# EAGLE design hot-plate_heater_v1.0 (EAGLE 6.2)

## Sheet 1 of 3
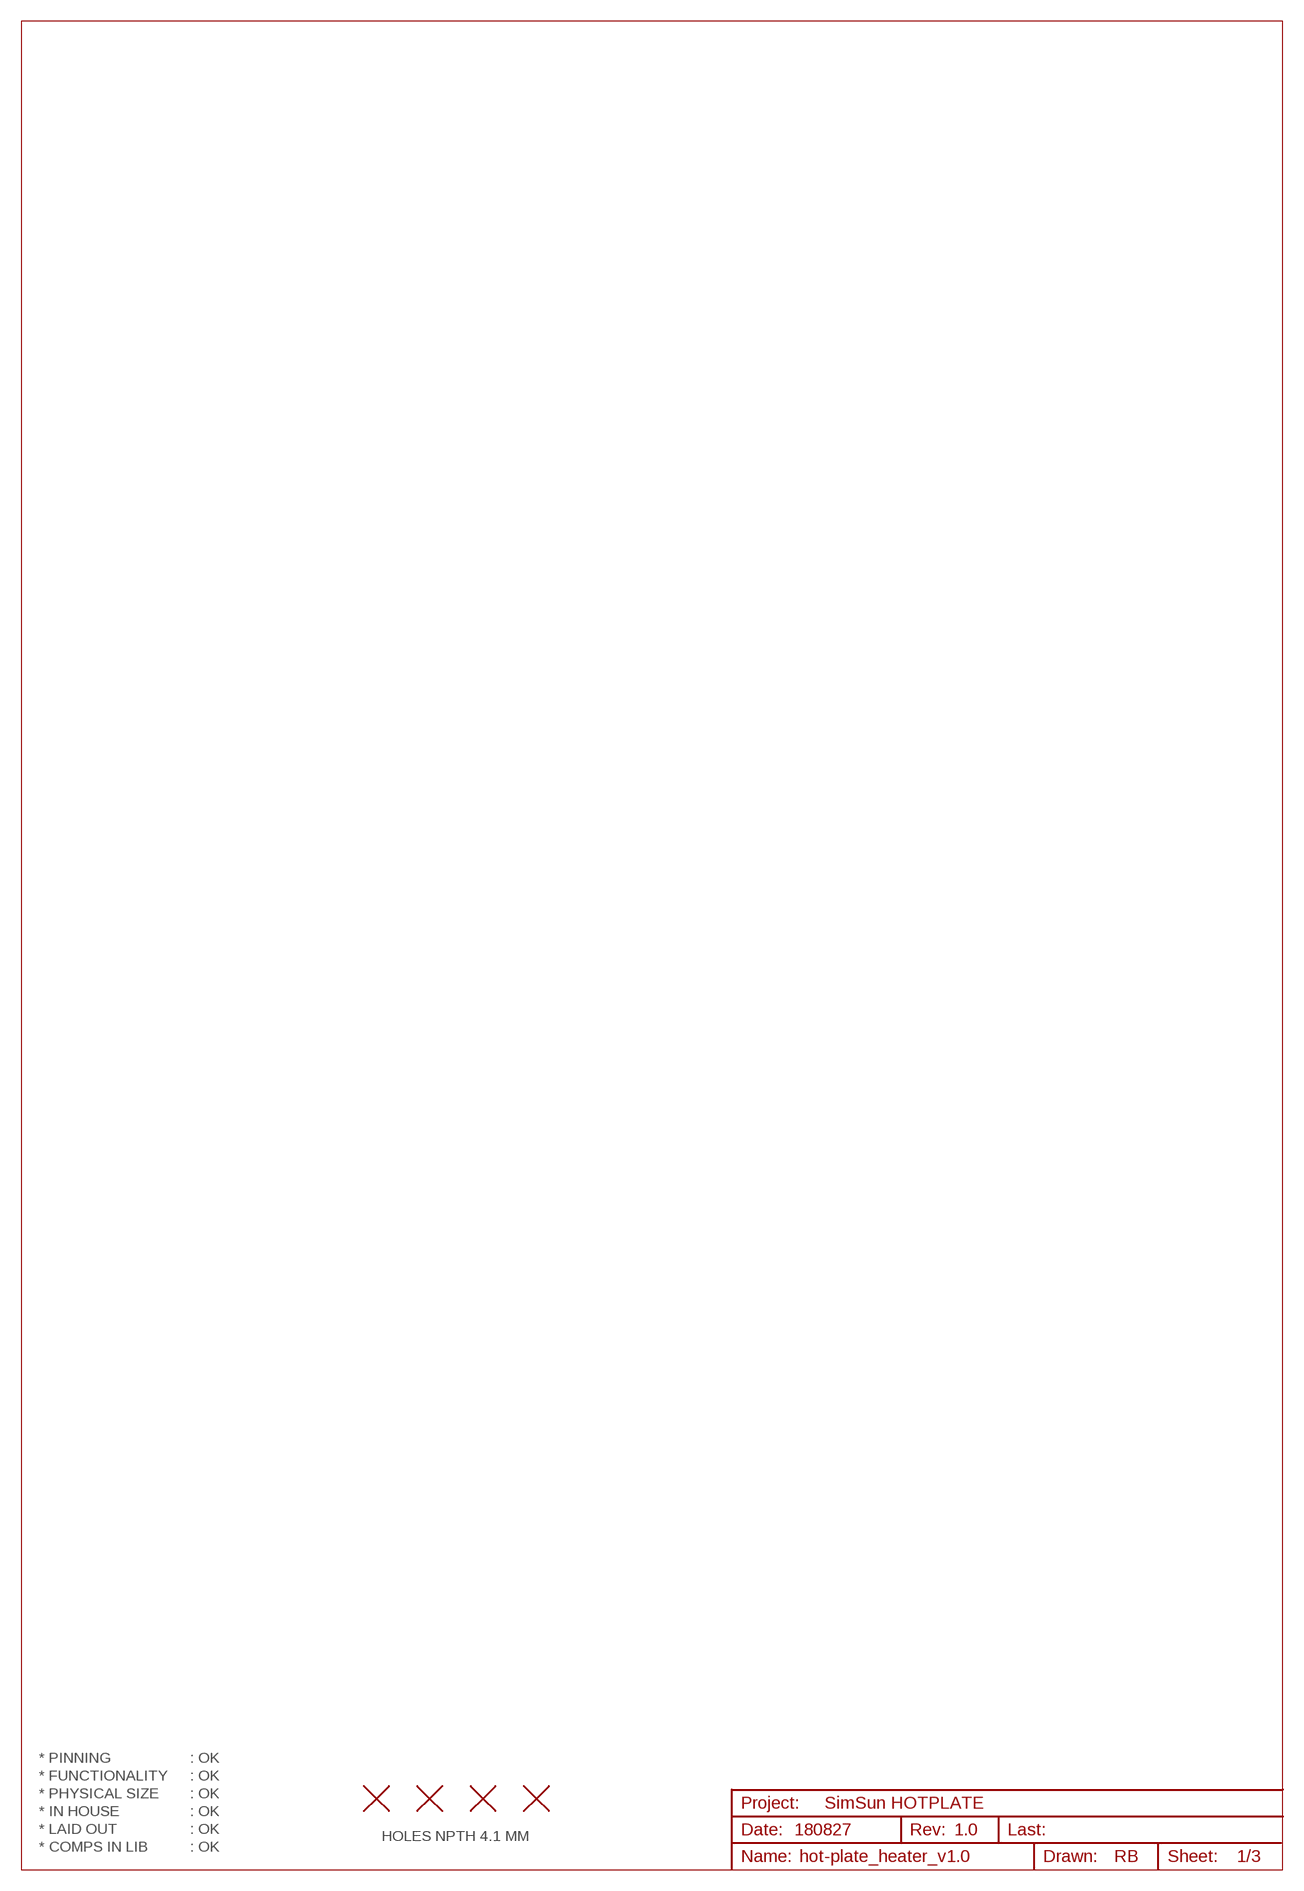
[diagram p0: schematic, sheet 1]

### Parts
H1  HOLE_NPTH_4.1MM  [HOLE_NPTH_4.1MM]
H2  HOLE_NPTH_4.1MM  [HOLE_NPTH_4.1MM]
H3  HOLE_NPTH_4.1MM  [HOLE_NPTH_4.1MM]
H4  HOLE_NPTH_4.1MM  [HOLE_NPTH_4.1MM]

### Notes on the sheet
- * PINNING | : OK
- * FUNCTIONALITY | : OK
- * PHYSICAL SIZE | : OK
- SimSun HOTPLATE
- * IN HOUSE | : OK
- * LAID OUT | : OK | 180827 | 1.0
- HOLES NPTH 4.1 MM
- * COMPS IN LIB | : OK

## Sheet 2 of 3
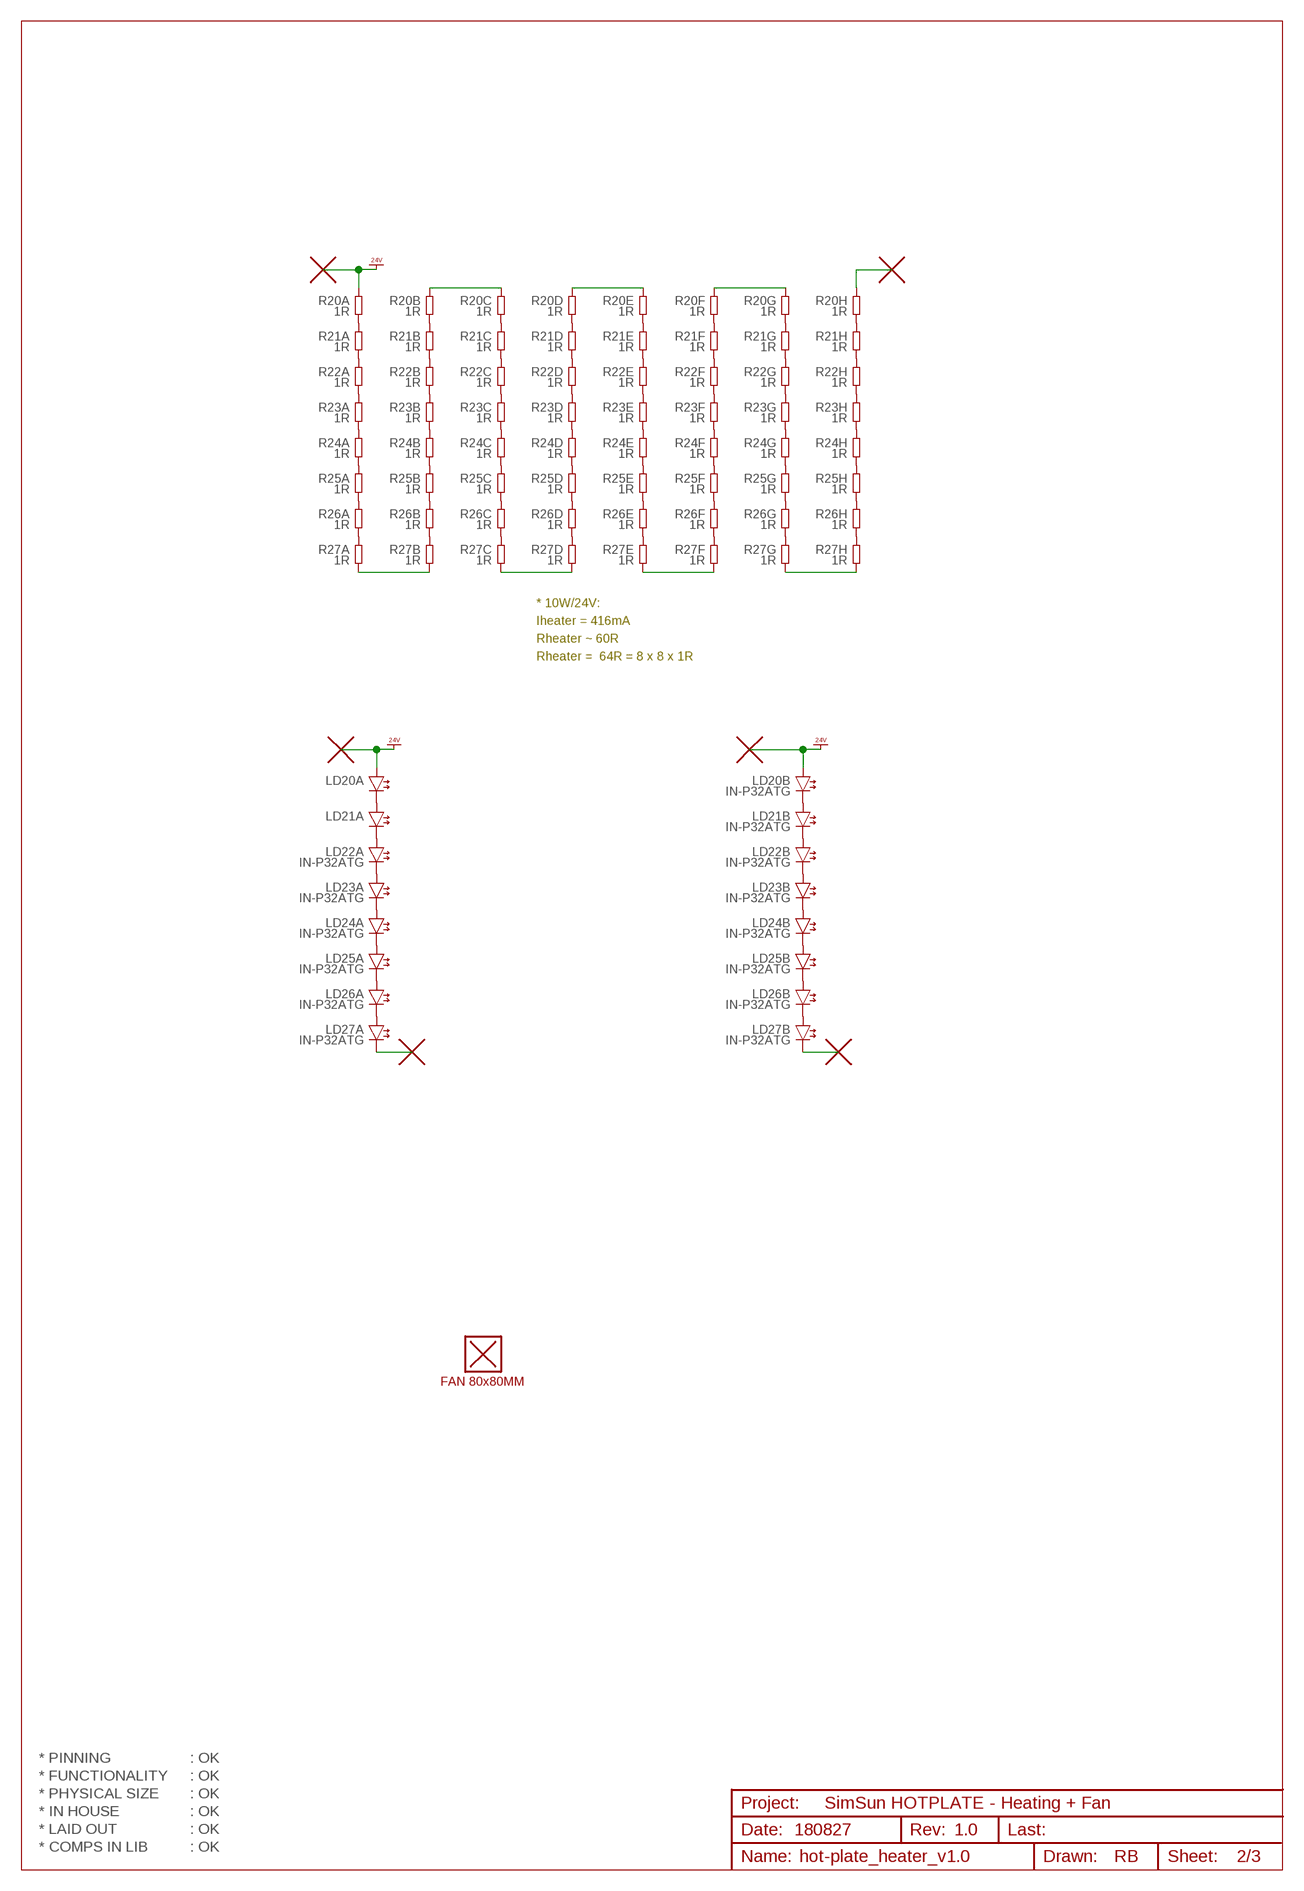
[diagram p1: schematic, sheet 2]

### Parts
H9  FAN_80X80MM_SANYO_SANACE80  [FAN_80X80MM_SANYO_SANACE80]
H18  PAD_ROUND_3.2MM  [PAD_ROUND_3.2MM]
H19  PAD_ROUND_3.2MM  [PAD_ROUND_3.2MM]
H20  PAD_ROUND_3.2MM  [PAD_ROUND_3.2MM]
H21  PAD_ROUND_3.2MM  [PAD_ROUND_3.2MM]
H22  PAD_ROUND_3.2MM  [PAD_ROUND_3.2MM]
H23  PAD_ROUND_3.2MM  [PAD_ROUND_3.2MM]
LD20A  IN-P32ATG  LED_SMD_PLCC2  [LED_SMD_PLCC2]
LD20B  IN-P32ATG  LED_SMD_PLCC2  [LED_SMD_PLCC2]
LD21A  IN-P32ATG  LED_SMD_PLCC2  [LED_SMD_PLCC2]
LD21B  IN-P32ATG  LED_SMD_PLCC2  [LED_SMD_PLCC2]
LD22A  IN-P32ATG  LED_SMD_PLCC2  [LED_SMD_PLCC2]
LD22B  IN-P32ATG  LED_SMD_PLCC2  [LED_SMD_PLCC2]
LD23A  IN-P32ATG  LED_SMD_PLCC2  [LED_SMD_PLCC2]
LD23B  IN-P32ATG  LED_SMD_PLCC2  [LED_SMD_PLCC2]
LD24A  IN-P32ATG  LED_SMD_PLCC2  [LED_SMD_PLCC2]
LD24B  IN-P32ATG  LED_SMD_PLCC2  [LED_SMD_PLCC2]
LD25A  IN-P32ATG  LED_SMD_PLCC2  [LED_SMD_PLCC2]
LD25B  IN-P32ATG  LED_SMD_PLCC2  [LED_SMD_PLCC2]
LD26A  IN-P32ATG  LED_SMD_PLCC2  [LED_SMD_PLCC2]
LD26B  IN-P32ATG  LED_SMD_PLCC2  [LED_SMD_PLCC2]
LD27A  IN-P32ATG  LED_SMD_PLCC2  [LED_SMD_PLCC2]
LD27B  IN-P32ATG  LED_SMD_PLCC2  [LED_SMD_PLCC2]
R20A  1R  RES2512  [RES2512]
R20B  1R  RES2512  [RES2512]
R20C  1R  RES2512  [RES2512]
R20D  1R  RES2512  [RES2512]
R20E  1R  RES2512  [RES2512]
R20F  1R  RES2512  [RES2512]
R20G  1R  RES2512  [RES2512]
R20H  1R  RES2512  [RES2512]
R21A  1R  RES2512  [RES2512]
R21B  1R  RES2512  [RES2512]
R21C  1R  RES2512  [RES2512]
R21D  1R  RES2512  [RES2512]
R21E  1R  RES2512  [RES2512]
R21F  1R  RES2512  [RES2512]
R21G  1R  RES2512  [RES2512]
R21H  1R  RES2512  [RES2512]
R22A  1R  RES2512  [RES2512]
R22B  1R  RES2512  [RES2512]
R22C  1R  RES2512  [RES2512]
R22D  1R  RES2512  [RES2512]
R22E  1R  RES2512  [RES2512]
R22F  1R  RES2512  [RES2512]
R22G  1R  RES2512  [RES2512]
R22H  1R  RES2512  [RES2512]
R23A  1R  RES2512  [RES2512]
R23B  1R  RES2512  [RES2512]
R23C  1R  RES2512  [RES2512]
R23D  1R  RES2512  [RES2512]
R23E  1R  RES2512  [RES2512]
R23F  1R  RES2512  [RES2512]
R23G  1R  RES2512  [RES2512]
R23H  1R  RES2512  [RES2512]
R24A  1R  RES2512  [RES2512]
R24B  1R  RES2512  [RES2512]
R24C  1R  RES2512  [RES2512]
R24D  1R  RES2512  [RES2512]
R24E  1R  RES2512  [RES2512]
R24F  1R  RES2512  [RES2512]
R24G  1R  RES2512  [RES2512]
R24H  1R  RES2512  [RES2512]
R25A  1R  RES2512  [RES2512]
R25B  1R  RES2512  [RES2512]
R25C  1R  RES2512  [RES2512]
R25D  1R  RES2512  [RES2512]
R25E  1R  RES2512  [RES2512]
R25F  1R  RES2512  [RES2512]
R25G  1R  RES2512  [RES2512]
R25H  1R  RES2512  [RES2512]
R26A  1R  RES2512  [RES2512]
R26B  1R  RES2512  [RES2512]
R26C  1R  RES2512  [RES2512]
R26D  1R  RES2512  [RES2512]
R26E  1R  RES2512  [RES2512]
R26F  1R  RES2512  [RES2512]
R26G  1R  RES2512  [RES2512]
R26H  1R  RES2512  [RES2512]
R27A  1R  RES2512  [RES2512]
R27B  1R  RES2512  [RES2512]
R27C  1R  RES2512  [RES2512]
R27D  1R  RES2512  [RES2512]
R27E  1R  RES2512  [RES2512]
R27F  1R  RES2512  [RES2512]
R27G  1R  RES2512  [RES2512]
R27H  1R  RES2512  [RES2512]

### Nets
N$1: H19.P R20H.1
N$4: R20A.2 R21A.1
N$5: R21A.2 R22A.1
N$6: R22A.2 R23A.1
N$7: R23A.2 R24A.1
N$8: R24A.2 R25A.1
N$9: R25A.2 R26A.1
N$10: R26A.2 R27A.1
N$11: R20B.2 R21B.1
N$12: R21B.2 R22B.1
N$14: R22B.2 R23B.1
N$15: R23B.2 R24B.1
N$16: R24B.2 R25B.1
N$17: R25B.2 R26B.1
N$18: R26B.2 R27B.1
N$19: R27A.2 R27B.2
N$20: R20C.2 R21C.1
N$21: R21C.2 R22C.1
N$22: R22C.2 R23C.1
N$23: R23C.2 R24C.1
N$24: R24C.2 R25C.1
N$26: R25C.2 R26C.1
N$27: R26C.2 R27C.1
N$28: R20B.1 R20C.1
N$29: R20D.2 R21D.1
N$30: R21D.2 R22D.1
N$31: R22D.2 R23D.1
N$32: R23D.2 R24D.1
N$33: R24D.2 R25D.1
N$34: R25D.2 R26D.1
N$35: R26D.2 R27D.1
N$36: R27C.2 R27D.2
N$37: R20E.2 R21E.1
N$38: R21E.2 R22E.1
N$39: R22E.2 R23E.1
N$40: R23E.2 R24E.1
N$41: R24E.2 R25E.1
N$42: R25E.2 R26E.1
N$43: R26E.2 R27E.1
N$44: R20D.1 R20E.1
N$45: R20F.2 R21F.1
N$46: R21F.2 R22F.1
N$47: R22F.2 R23F.1
N$48: R23F.2 R24F.1
N$49: R24F.2 R25F.1
N$50: R25F.2 R26F.1
N$51: R26F.2 R27F.1
N$52: R27E.2 R27F.2
N$53: R20G.2 R21G.1
N$54: R21G.2 R22G.1
N$55: R22G.2 R23G.1
N$56: R23G.2 R24G.1
N$57: R24G.2 R25G.1
N$58: R25G.2 R26G.1
N$59: R26G.2 R27G.1
N$60: R20F.1 R20G.1
N$61: R20H.2 R21H.1
N$62: R21H.2 R22H.1
N$63: R22H.2 R23H.1
N$64: R23H.2 R24H.1
N$65: R24H.2 R25H.1
N$66: R25H.2 R26H.1
N$67: R26H.2 R27H.1
N$68: R27G.2 R27H.2
N$71: LD20A.C(-) LD21A.A(+)
N$72: LD21A.C(-) LD22A.A(+)
N$73: LD22A.C(-) LD23A.A(+)
N$74: LD23A.C(-) LD24A.A(+)
N$75: LD24A.C(-) LD25A.A(+)
N$76: LD25A.C(-) LD26A.A(+)
N$77: LD20B.C(-) LD21B.A(+)
N$78: LD21B.C(-) LD22B.A(+)
N$79: LD22B.C(-) LD23B.A(+)
N$80: LD23B.C(-) LD24B.A(+)
N$81: LD24B.C(-) LD25B.A(+)
N$82: LD25B.C(-) LD26B.A(+)
N$83: LD26A.C(-) LD27A.A(+)
N$84: LD26B.C(-) LD27B.A(+)
N$85: H23.P LD27B.C(-)
N$86: H22.P LD27A.C(-)
VDD_24V: H18.P H20.P H21.P LD20A.A(+) LD20B.A(+) R20A.1 ; supply symbol labelled VCC_24V

### Notes on the sheet
- * 10W/24V:
- Iheater = 416mA
- Rheater ~ 60R
- Rheater =  64R = 8 x 8 x 1R
- * PINNING | : OK
- * FUNCTIONALITY | : OK
- * PHYSICAL SIZE | : OK
- SimSun HOTPLATE - Heating + Fan
- * IN HOUSE | : OK
- * LAID OUT | : OK | 180827 | 1.0
- * COMPS IN LIB | : OK

## Sheet 3 of 3
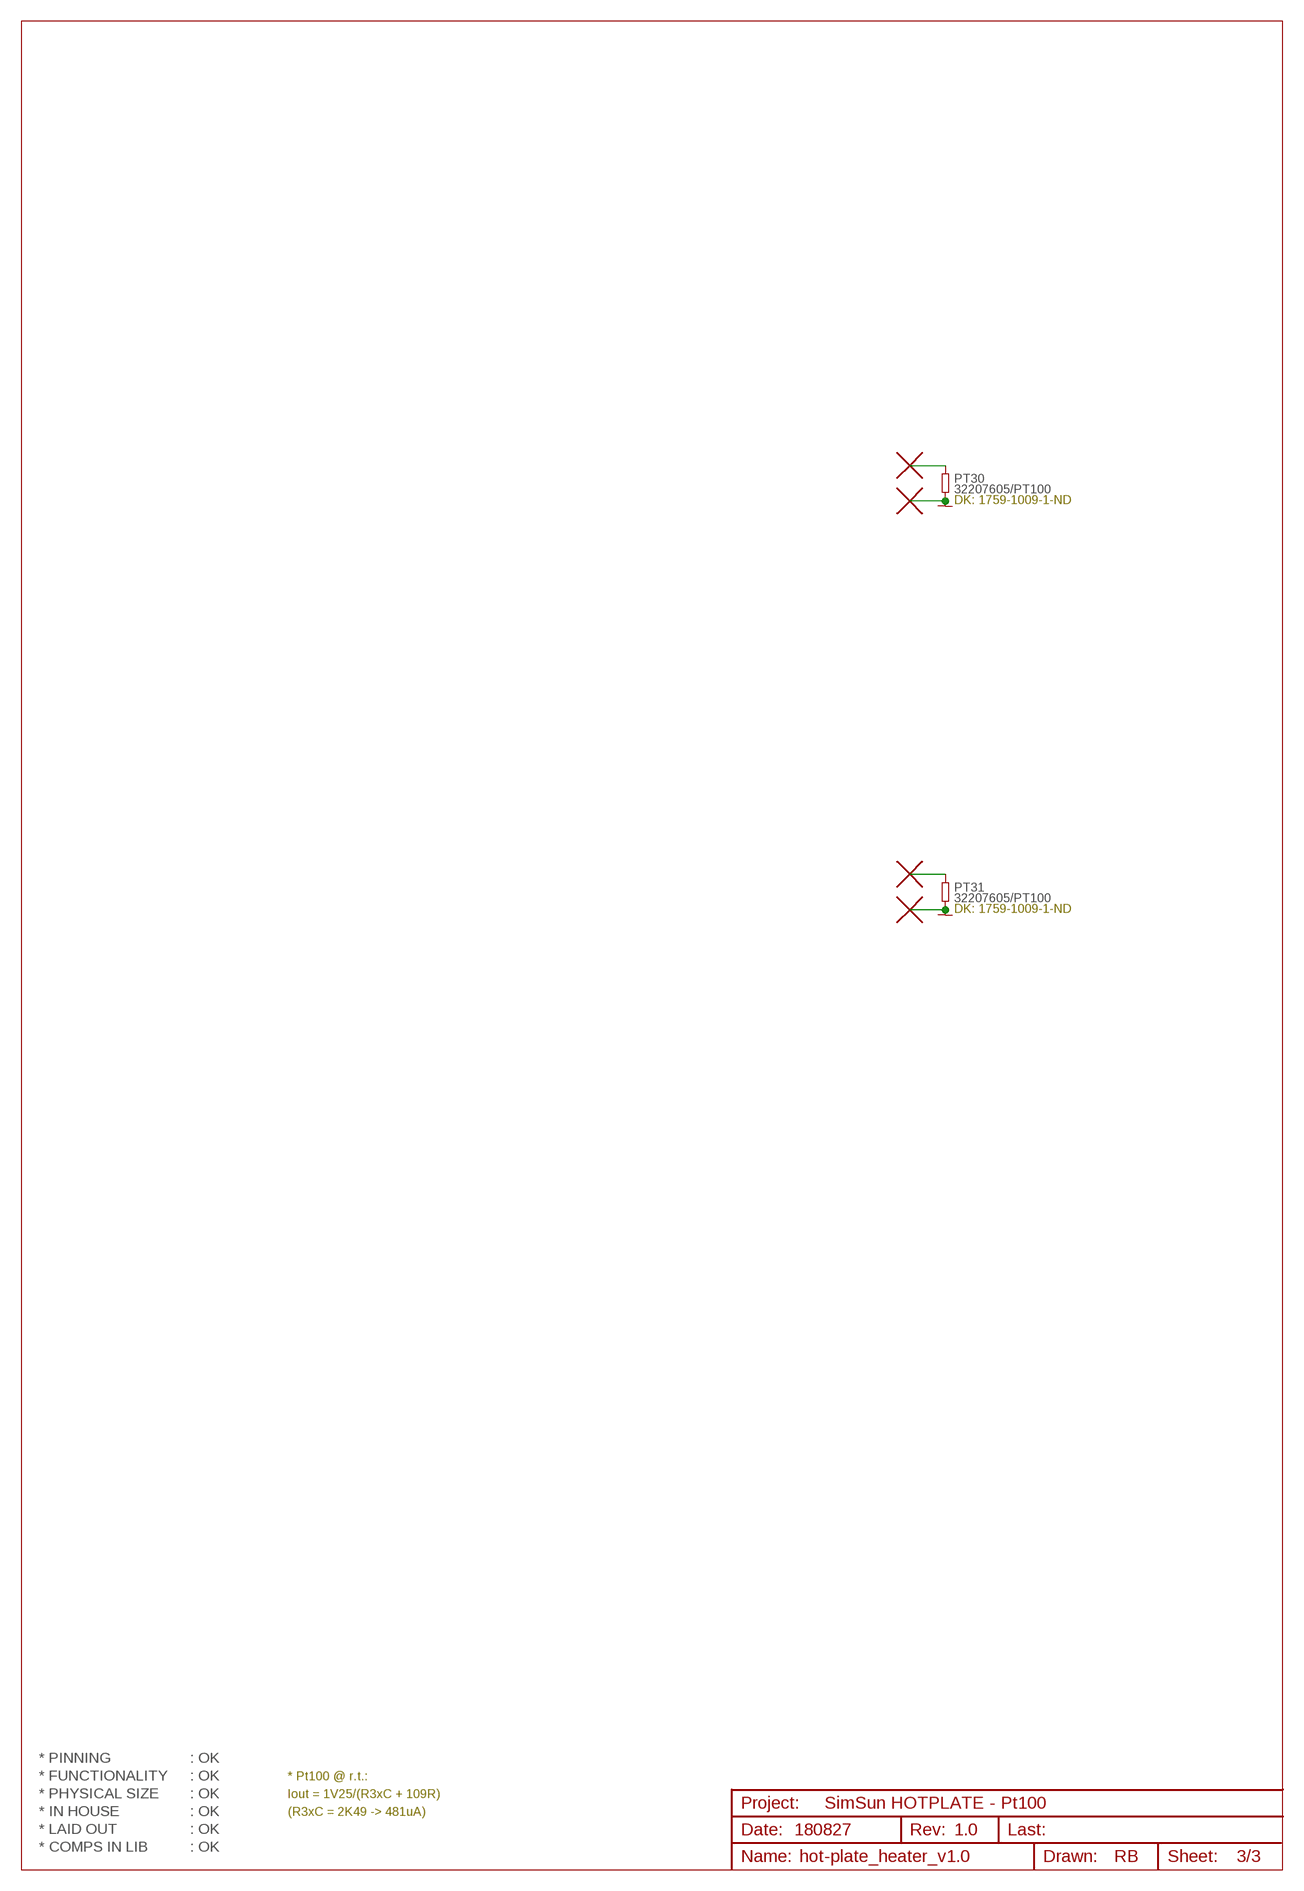
[diagram p2: schematic, sheet 3]

### Parts
H24  PAD_ROUND_3.2MM  [PAD_ROUND_3.2MM]
H25  PAD_ROUND_3.2MM  [PAD_ROUND_3.2MM]
H26  PAD_ROUND_3.2MM  [PAD_ROUND_3.2MM]
H27  PAD_ROUND_3.2MM  [PAD_ROUND_3.2MM]
PT30  32207605/PT100  RES0805  [RES0805]
PT31  32207605/PT100  RES0805  [RES0805]

### Nets
GND: H25.P H27.P PT30.2 PT31.2
RTD30: H24.P PT30.1
RTD31: H26.P PT31.1

### Notes on the sheet
- DK: 1759-1009-1-ND
- DK: 1759-1009-1-ND
- * PINNING | : OK
- * FUNCTIONALITY | : OK | * Pt100 @ r.t.:
- * PHYSICAL SIZE | : OK | Iout = 1V25/(R3xC + 109R)
- SimSun HOTPLATE - Pt100
- * IN HOUSE | : OK | (R3xC = 2K49 -> 481uA)
- * LAID OUT | : OK | 180827 | 1.0
- * COMPS IN LIB | : OK

## Library data of the parts
H1-H4 = 00-own_parts:HOLE_NPTH_4.1MM: Hole, NPTH, 4.1mm
H9 = 00-own_parts:FAN_80X80MM_SANYO_SANACE80: Fan, 80x80MM, Sanyo 9GA0824P7G001, with PWM control function & pulse sensor, DK# 1688-1603-ND
H18-H27 = 00-own_parts:PAD_ROUND_3.2MM: Pad, SMD, round 3.2mm
LD20A LD20B LD21A LD21B LD22A LD22B LD23A LD23B LD24A LD24B LD25A LD25B LD26A LD26B LD27A LD27B = 00-own_parts:LED_SMD_PLCC2: LED, SMD, PLCC2
PT30 PT31 R20A R20B R20C R20D R20E R20F R20G R20H R21A R21B R21C R21D R21E R21F R21G R21H R22A R22B R22C R22D R22E R22F R22G R22H R23A R23B R23C R23D R23E R23F R23G R23H R24A R24B R24C R24D R24E R24F R24G R24H R25A R25B R25C R25D R25E R25F R25G R25H R26A R26B R26C R26D R26E R26F R26G R26H R27A R27B R27C R27D R27E R27F R27G R27H = 00-own_parts:RES

## Board
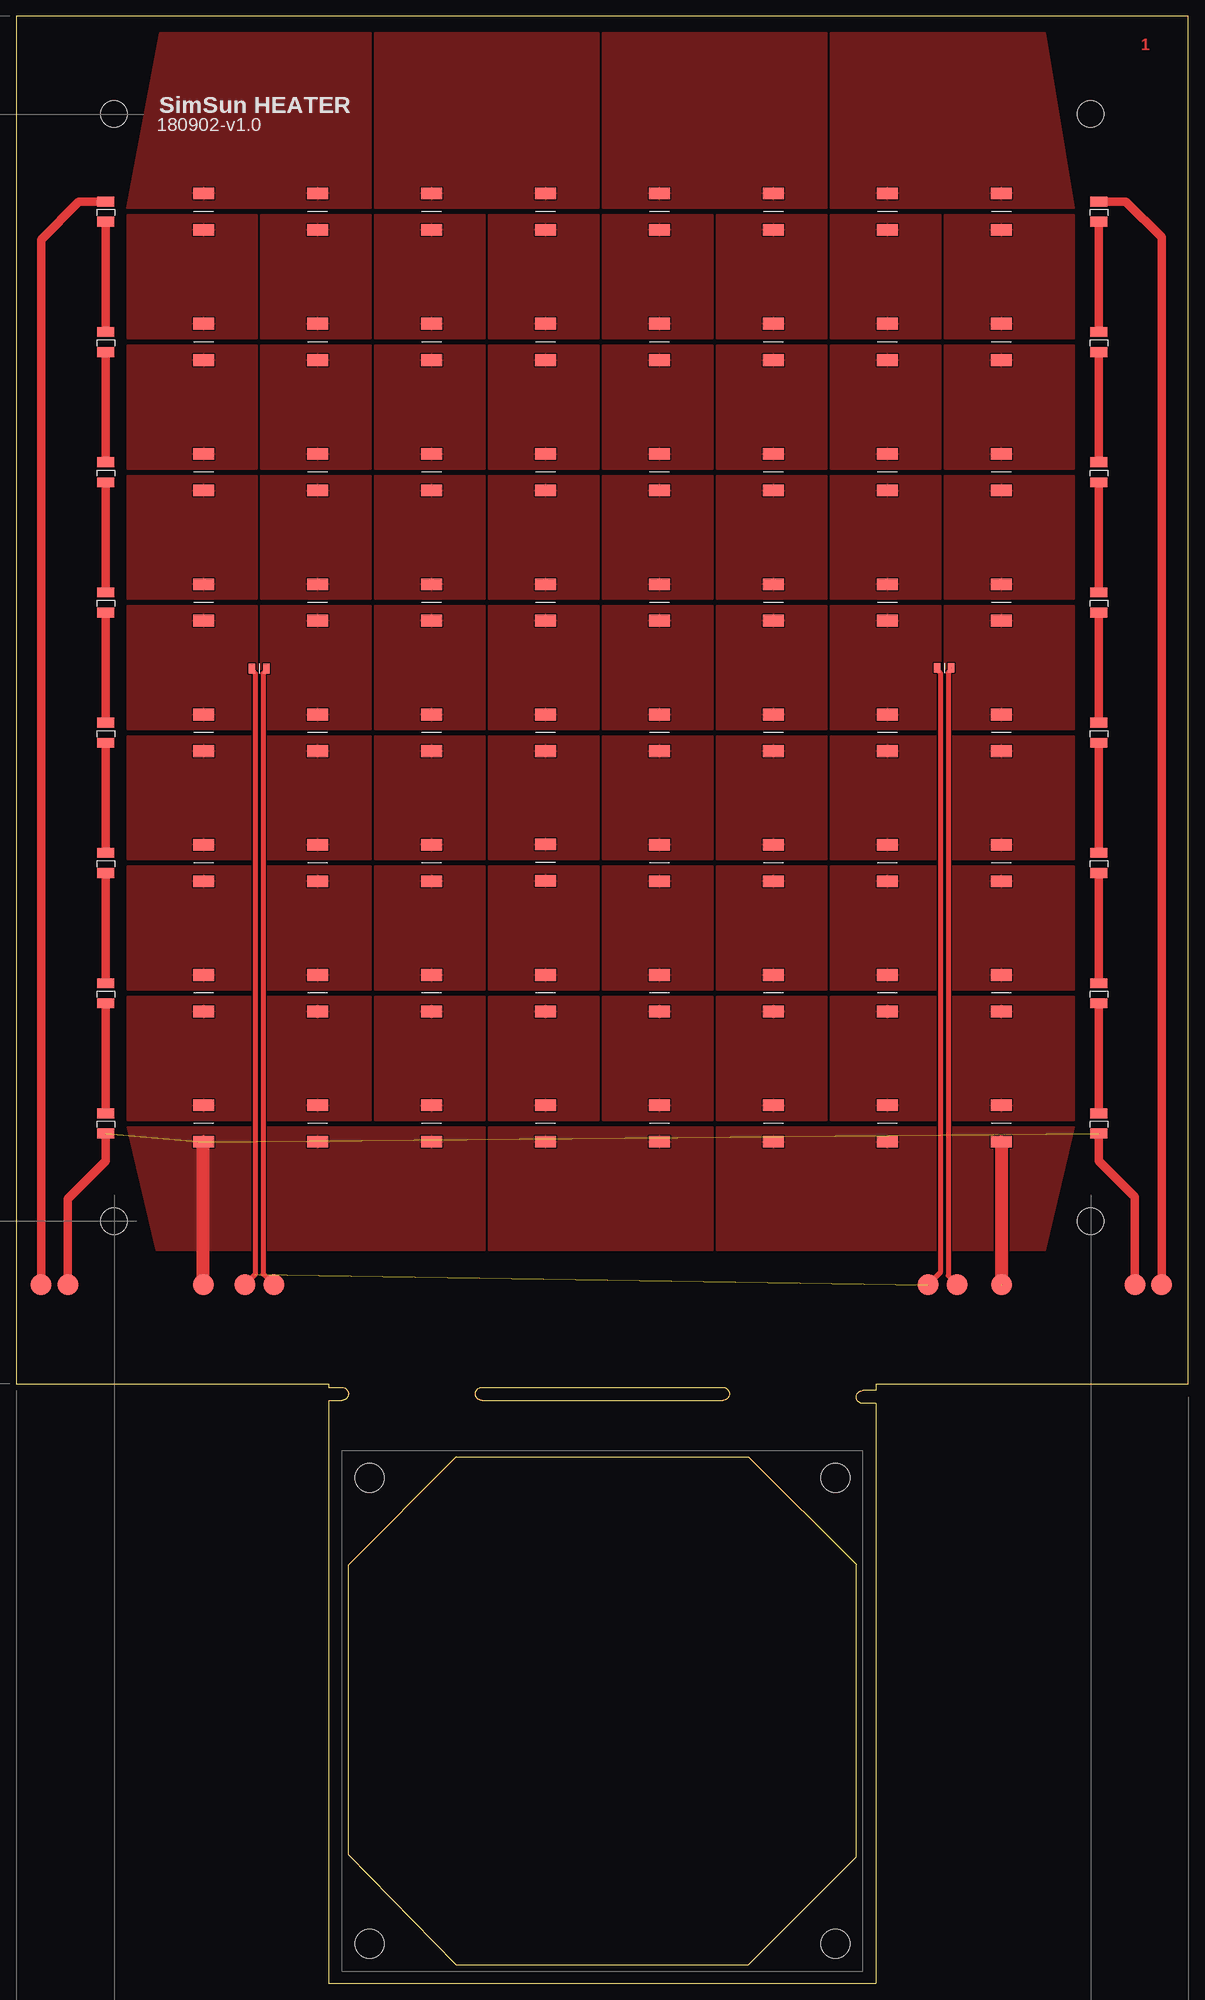
[diagram p3: board, top side]

Size 180 x 302 mm. Coordinates in mm from the lower left corner, seen from the top.
Outline: 0,92 48,92 48,91.5 50,91.5 arc-180 50,89.5 48,89.5 48,0 132,0 132,89 130,89 arc-180 130,91 132,91 132,92 180,92 180,302 0,302 0,92
Copper layers 1: Top 0.035mm
Design rules: minimum track width 0.15mm, minimum drill 1mm, track to track 0.2mm, track to pad 0.2mm, pad to pad 0.2mm, via to via 0.2mm, smd to smd 0.2mm, copper to edge 0.45mm, drill to drill 0.3mm, minimum pad ring 0.325mm, minimum via ring 0.325mm, stop-mask expansion 0.1mm, vias tented up to drill 0mil, thermal gap 0.2mm
Milling: 4 lines

### Footprints (pad centres in the part's own frame; a part is rotated, then mirrored left to right if it is on the bottom)
HOLE_NPTH_4.1MM = hole 4.1: 0,0
FAN_80X80MM_SANYO_SANACE80 = hole 4.5: -35.75,-35.75; 35.75,-35.75; -35.75,35.75; 35.75,35.75
PAD_ROUND_3.2MM = smd 3.2 x 3.2: P 0,0
LED_SMD_PLCC2 = smd 1.5 x 2.6: A -1.55,0; C 1.55,0
RES0805 = smd 1 x 1.5: 1 -1.1,0; 2 1.1,0
RES2512 = smd 1.8 x 3.2: 1 -2.8,0; 2 2.8,0

### Placement (x,y rotation side)
H1  165,287 0 top
H2  15,117 0 top
H3  165,117 0 top
H4  15,287 0 top
H9  90.01,41.83 0 top
H18  7.94,107.24 90 top
H19  151.29,107.24 90 top
H20  171.77,107.24 90 top
H21  28.73,107.24 90 top
H22  3.81,107.24 90 top
H23  175.89,107.24 90 top
H24  144.46,107.24 90 top
H25  140.02,107.24 90 top
H26  39.53,107.24 90 top
H27  35.08,107.24 90 top
LD20A  13.75,132 90 top
LD20B  166.25,132 90 top
LD21A  13.75,152 90 top
LD21B  166.25,152 90 top
LD22A  13.75,172 90 top
LD22B  166.25,172 90 top
LD23A  13.75,192 90 top
LD23B  166.25,192 90 top
LD24A  13.75,212 90 top
LD24B  166.25,212 90 top
LD25A  13.75,232 90 top
LD25B  166.25,232 90 top
LD26A  13.75,252 90 top
LD26B  166.25,252 90 top
LD27A  13.75,272 90 top
LD27B  166.25,272 90 top
PT30  142.49,201.95 180 top
PT31  37.3,201.85 180 top
R20A  28.75,132 90 top
R20B  46.25,132 90 top
R20C  63.75,132 90 top
R20D  81.25,132 90 top
R20E  98.75,132 90 top
R20F  116.25,132 90 top
R20G  133.75,132 90 top
R20H  151.25,132 90 top
R21A  28.75,152 90 top
R21B  46.25,152 90 top
R21C  63.75,152 90 top
R21D  81.25,152 90 top
R21E  98.75,152 90 top
R21F  116.25,152 90 top
R21G  133.75,152 90 top
R21H  151.25,152 90 top
R22A  28.75,172 90 top
R22B  46.25,172 90 top
R22C  63.75,172 90 top
R22D  81.25,172.05 90 top
R22E  98.75,172 90 top
R22F  116.25,172 90 top
R22G  133.75,172 90 top
R22H  151.25,172 90 top
R23A  28.75,192 90 top
R23B  46.25,192 90 top
R23C  63.75,192 90 top
R23D  81.25,192 90 top
R23E  98.75,192 90 top
R23F  116.25,192 90 top
R23G  133.75,192 90 top
R23H  151.25,192 90 top
R24A  28.75,212 90 top
R24B  46.25,212 90 top
R24C  63.75,212 90 top
R24D  81.25,212 90 top
R24E  98.75,212 90 top
R24F  116.25,212 90 top
R24G  133.75,212 90 top
R24H  151.25,212 90 top
R25A  28.75,232 90 top
R25B  46.25,232 90 top
R25C  63.75,232 90 top
R25D  81.25,232 90 top
R25E  98.75,232 90 top
R25F  116.25,232 90 top
R25G  133.75,232 90 top
R25H  151.25,232 90 top
R26A  28.75,252 90 top
R26B  46.25,252 90 top
R26C  63.75,252 90 top
R26D  81.25,252 90 top
R26E  98.75,252 90 top
R26F  116.25,252 90 top
R26G  133.75,252 90 top
R26H  151.25,252 90 top
R27A  28.75,272 90 top
R27B  46.25,272 90 top
R27C  63.75,272 90 top
R27D  81.25,272 90 top
R27E  98.75,272 90 top
R27F  116.25,272 90 top
R27G  133.75,272 90 top
R27H  151.25,272 90 top

### Tracks (layer width: path | path; a pad name or v marks a point on that pad's centre or on a via)
GND  (1 unrouted)
  Top 0.762: PT31.2 36.2,201.59 36.7,201.1 36.7,108.86 H27.P | PT30.2 141.39,201.71 141.9,201.2 141.9,109.12 H25.P
N$1  (1 unrouted)
  Top 2.032: R20H.1 151.25,107.28
N$4
  pour Top: 17,132.5 37,132.5 37,151.5 17,151.5
N$5
  pour Top: 17,152.5 37,152.5 37,171.5 17,171.5
N$6
  pour Top: 17,172.5 37,172.5 37,191.5 17,191.5
N$7
  pour Top: 17,192.5 37,192.5 37,211.5 17,211.5
N$8
  pour Top: 17,212.5 37,212.5 37,231.5 17,231.5
N$9
  pour Top: 17,232.5 37,232.5 37,251.5 17,251.5
N$10
  pour Top: 17,252.5 37,252.5 37,271.5 17,271.5
N$11
  pour Top: 37.5,132.5 54.5,132.5 54.5,151.5 37.5,151.5
N$12
  pour Top: 37.5,152.5 54.5,152.5 54.5,171.5 37.5,171.5
N$14
  pour Top: 37.5,172.5 54.5,172.5 54.5,191.5 37.5,191.5
N$15
  pour Top: 37.5,192.5 54.5,192.5 54.5,211.5 37.5,211.5
N$16
  pour Top: 37.5,212.5 54.5,212.5 54.5,231.5 37.5,231.5
N$17
  pour Top: 37.5,232.5 54.5,232.5 54.5,251.5 37.5,251.5
N$18
  pour Top: 37.5,252.5 54.5,252.5 54.5,271.5 37.5,271.5
N$19
  pour Top: 16.92,272.5 54.5,272.5 54.5,299.5 22,299.5
N$20
  pour Top: 55,132.5 72,132.5 72,151.5 55,151.5
N$21
  pour Top: 55,152.5 72,152.5 72,171.5 55,171.5
N$22
  pour Top: 55,172.5 72,172.5 72,191.5 55,191.5
N$23
  pour Top: 55,192.5 72,192.5 72,211.5 55,211.5
N$24
  pour Top: 55,212.5 72,212.5 72,231.5 55,231.5
N$26
  pour Top: 55,232.5 72,232.5 72,251.5 55,251.5
N$27
  pour Top: 55,252.5 72,252.5 72,271.5 55,271.5
N$28
  pour Top: 37.5,112.5 72,112.5 72,131.5 37.5,131.5
N$29
  pour Top: 72.5,132.5 89.5,132.5 89.5,151.5 72.5,151.5
N$30
  pour Top: 72.5,152.5 89.5,152.5 89.5,171.5 72.5,171.5
N$31
  pour Top: 72.5,172.5 89.5,172.5 89.5,191.5 72.5,191.5
N$32
  pour Top: 72.5,192.5 89.5,192.5 89.5,211.5 72.5,211.5
N$33
  pour Top: 72.5,212.5 89.5,212.5 89.5,231.5 72.5,231.5
N$34
  pour Top: 72.5,232.5 89.5,232.5 89.5,251.5 72.5,251.5
N$35
  pour Top: 72.5,252.5 89.5,252.5 89.5,271.5 72.5,271.5
N$36
  pour Top: 55,272.5 89.5,272.5 89.5,299.5 55,299.5
N$37
  pour Top: 90,132.5 107,132.5 107,151.5 90,151.5
N$38
  pour Top: 90,152.5 107,152.5 107,171.5 90,171.5
N$39
  pour Top: 90,172.5 107,172.5 107,191.5 90,191.5
N$40
  pour Top: 90,192.5 107,192.5 107,211.5 90,211.5
N$41
  pour Top: 90,212.5 107,212.5 107,231.5 90,231.5
N$42
  pour Top: 90,232.5 107,232.5 107,251.5 90,251.5
N$43
  pour Top: 90,252.5 107,252.5 107,271.5 90,271.5
N$44
  pour Top: 72.5,112.5 107,112.5 107,131.5 72.5,131.5
N$45
  pour Top: 107.5,132.5 124.5,132.5 124.5,151.5 107.5,151.5
N$46
  pour Top: 107.5,152.5 124.5,152.5 124.5,171.5 107.5,171.5
N$47
  pour Top: 107.5,172.5 124.5,172.5 124.5,191.5 107.5,191.5
N$48
  pour Top: 107.5,192.5 124.5,192.5 124.5,211.5 107.5,211.5
N$49
  pour Top: 107.5,212.5 124.5,212.5 124.5,231.5 107.5,231.5
N$50
  pour Top: 107.5,232.5 124.5,232.5 124.5,251.5 107.5,251.5
N$51
  pour Top: 107.5,252.5 124.5,252.5 124.5,271.5 107.5,271.5
N$52
  pour Top: 90,272.5 124.5,272.5 124.5,299.5 90,299.5
N$53
  pour Top: 125,132.5 142,132.5 142,151.5 125,151.5
N$54
  pour Top: 125,152.5 142,152.5 142,171.5 125,171.5
N$55
  pour Top: 125,172.5 142,172.5 142,191.5 125,191.5
N$56
  pour Top: 125,192.5 142,192.5 142,211.5 125,211.5
N$57
  pour Top: 125,212.5 142,212.5 142,231.5 125,231.5
N$58
  pour Top: 125,232.5 142,232.5 142,251.5 125,251.5
N$59
  pour Top: 125,252.5 142,252.5 142,271.5 125,271.5
N$60
  pour Top: 107.5,112.5 142,112.5 142,131.5 107.5,131.5
N$61
  pour Top: 142.5,132.5 162.5,132.5 162.5,151.5 142.5,151.5
N$62
  pour Top: 142.5,152.5 162.5,152.5 162.5,171.5 142.5,171.5
N$63
  pour Top: 142.5,172.5 162.5,172.5 162.5,191.5 142.5,191.5
N$64
  pour Top: 142.5,192.5 162.5,192.5 162.5,211.5 142.5,211.5
N$65
  pour Top: 142.5,212.5 162.5,212.5 162.5,231.5 142.5,231.5
N$66
  pour Top: 142.5,232.5 162.5,232.5 162.5,251.5 142.5,251.5
N$67
  pour Top: 142.5,252.5 162.5,252.5 162.5,271.5 142.5,271.5
N$68
  pour Top: 125,272.5 162.44,272.5 158,299.5 125,299.5
N$69
  pour Top: 142.5,112.5 158,112.5 162.44,131.5 142.5,131.5
N$71
  Top 1.27: LD20A.C LD21A.A
N$72
  Top 1.27: LD21A.C LD22A.A
N$73
  Top 1.27: LD22A.C LD23A.A
N$74
  Top 1.27: LD24A.A LD23A.C
N$75
  Top 1.27: LD24A.C LD25A.A
N$76
  Top 1.27: LD25A.C LD26A.A
N$77
  Top 1.27: LD20B.C LD21B.A
N$78
  Top 1.27: LD21B.C LD22B.A
N$79
  Top 1.27: LD22B.C LD23B.A
N$80
  Top 1.27: LD23B.C LD24B.A
N$81
  Top 1.27: LD24B.C LD25B.A
N$82
  Top 1.27: LD25B.C LD26B.A
N$83
  Top 1.27: LD26A.C LD27A.A
N$84
  Top 1.27: LD26B.C LD27B.A
N$85
  Top 0.762: H23.P
  Top 1.27: H23.P 175.89,268.05 170.4,273.55 LD27B.C
N$86
  Top 0.762: H22.P
  Top 1.27: H22.P 3.81,267.73 9.62,273.55 LD27A.C
RTD30  (1 unrouted)
  Top 0.762: 143.59,201.93 143.59,201.69 143.1,201.2 143.1,108.6 H24.P
RTD31
  Top 0.762: PT31.1 38.41,201.61 37.9,201.1 37.9,108.86 H26.P
VDD_24V  (2 unrouted)
  Top 1.27: LD20A.A 13.75,126.23 7.94,120.41 H18.P | H20.P 171.77,120.73 166.25,126.25 LD20B.A
  Top 2.032: H21.P 28.73,129.18 R20A.1
  pour Top: 21.5,112.5 37,112.5 37,131.5 17.05,131.5

### Text on the board
Top: 1
tPlace: SimSun HEATER | 180902-v1.0
tDocu: 210 MM | 170 MM | 150 MM | 180 MM